# EAGLE design LED_Board (EAGLE 9.1.2)
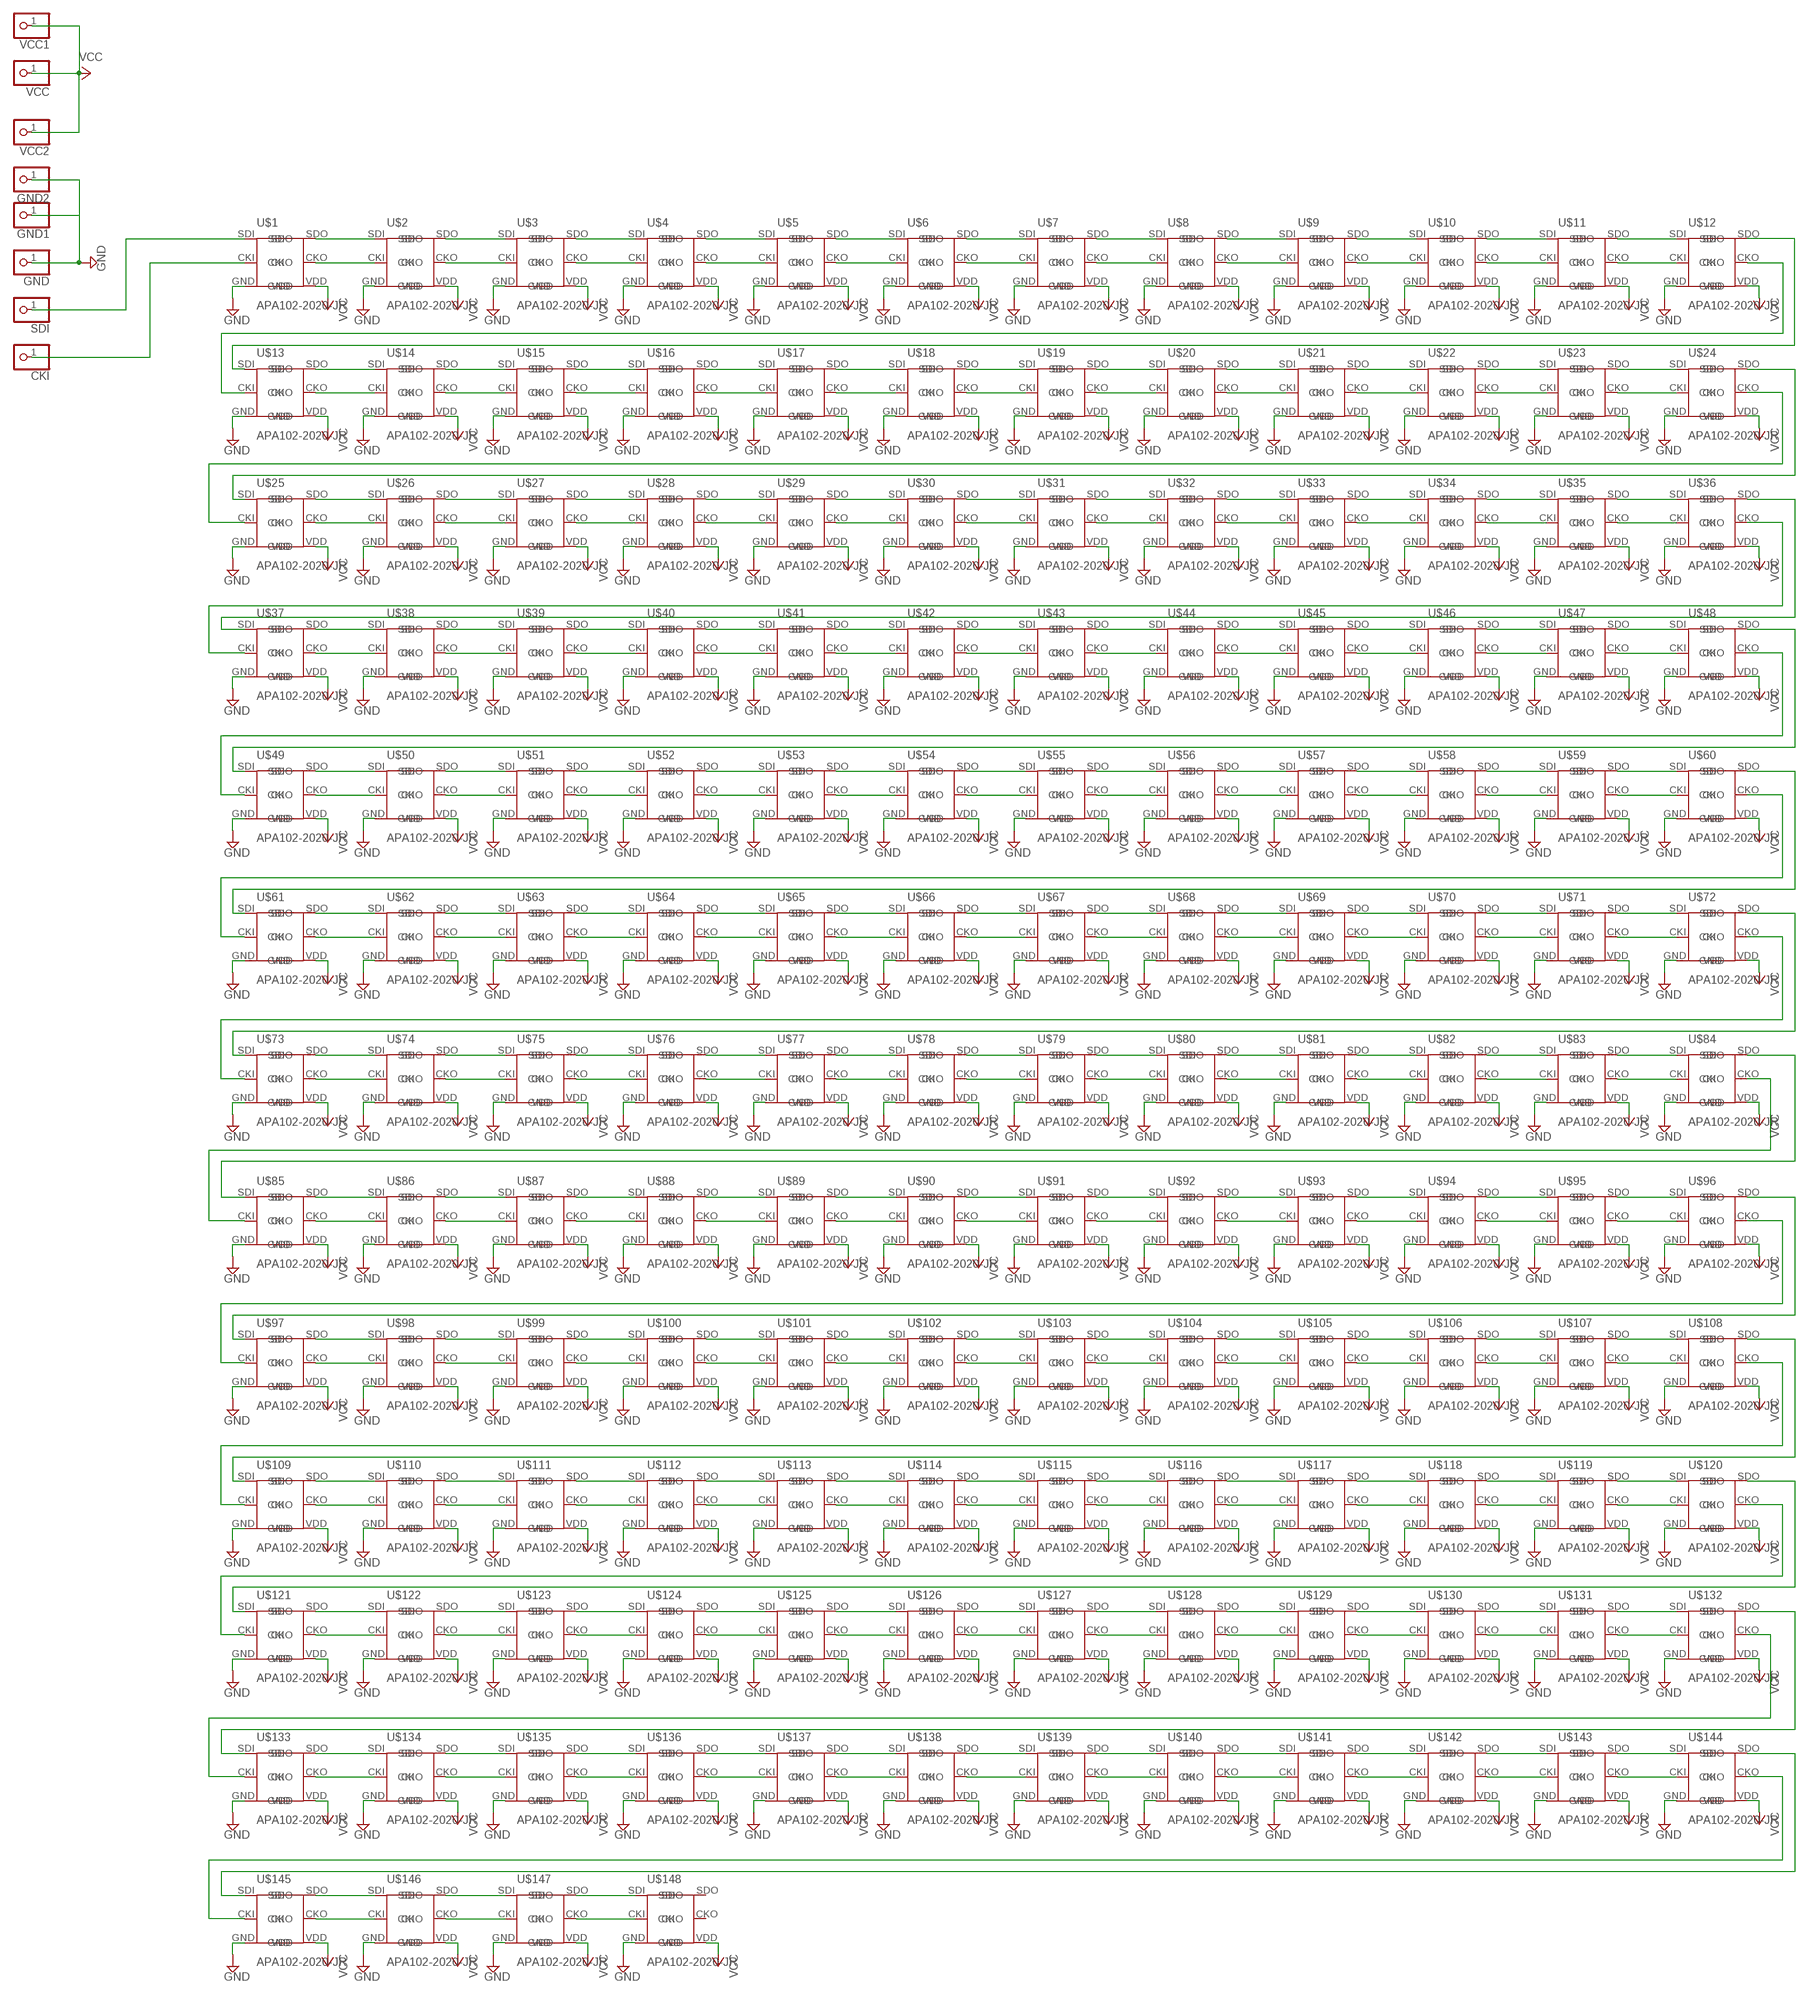
[diagram p0: schematic, sheet 1]

## Parts
CKI  PINHD-1X1  [1X01]
GND  PINHD-1X1  [1X01]
GND1  PINHD-1X1  [1X01]
GND2  PINHD-1X1  [1X01]
SDI  PINHD-1X1  [1X01]
U$1  APA102-2020-JR  [APA102-2020-JR]
U$2  APA102-2020-JR  [APA102-2020-JR]
U$3  APA102-2020-JR  [APA102-2020-JR]
U$4  APA102-2020-JR  [APA102-2020-JR]
U$5  APA102-2020-JR  [APA102-2020-JR]
U$6  APA102-2020-JR  [APA102-2020-JR]
U$7  APA102-2020-JR  [APA102-2020-JR]
U$8  APA102-2020-JR  [APA102-2020-JR]
U$9  APA102-2020-JR  [APA102-2020-JR]
U$10  APA102-2020-JR  [APA102-2020-JR]
U$11  APA102-2020-JR  [APA102-2020-JR]
U$12  APA102-2020-JR  [APA102-2020-JR]
U$13  APA102-2020-JR  [APA102-2020-JR]
U$14  APA102-2020-JR  [APA102-2020-JR]
U$15  APA102-2020-JR  [APA102-2020-JR]
U$16  APA102-2020-JR  [APA102-2020-JR]
U$17  APA102-2020-JR  [APA102-2020-JR]
U$18  APA102-2020-JR  [APA102-2020-JR]
U$19  APA102-2020-JR  [APA102-2020-JR]
U$20  APA102-2020-JR  [APA102-2020-JR]
U$21  APA102-2020-JR  [APA102-2020-JR]
U$22  APA102-2020-JR  [APA102-2020-JR]
U$23  APA102-2020-JR  [APA102-2020-JR]
U$24  APA102-2020-JR  [APA102-2020-JR]
U$25  APA102-2020-JR  [APA102-2020-JR]
U$26  APA102-2020-JR  [APA102-2020-JR]
U$27  APA102-2020-JR  [APA102-2020-JR]
U$28  APA102-2020-JR  [APA102-2020-JR]
U$29  APA102-2020-JR  [APA102-2020-JR]
U$30  APA102-2020-JR  [APA102-2020-JR]
U$31  APA102-2020-JR  [APA102-2020-JR]
U$32  APA102-2020-JR  [APA102-2020-JR]
U$33  APA102-2020-JR  [APA102-2020-JR]
U$34  APA102-2020-JR  [APA102-2020-JR]
U$35  APA102-2020-JR  [APA102-2020-JR]
U$36  APA102-2020-JR  [APA102-2020-JR]
U$37  APA102-2020-JR  [APA102-2020-JR]
U$38  APA102-2020-JR  [APA102-2020-JR]
U$39  APA102-2020-JR  [APA102-2020-JR]
U$40  APA102-2020-JR  [APA102-2020-JR]
U$41  APA102-2020-JR  [APA102-2020-JR]
U$42  APA102-2020-JR  [APA102-2020-JR]
U$43  APA102-2020-JR  [APA102-2020-JR]
U$44  APA102-2020-JR  [APA102-2020-JR]
U$45  APA102-2020-JR  [APA102-2020-JR]
U$46  APA102-2020-JR  [APA102-2020-JR]
U$47  APA102-2020-JR  [APA102-2020-JR]
U$48  APA102-2020-JR  [APA102-2020-JR]
U$49  APA102-2020-JR  [APA102-2020-JR]
U$50  APA102-2020-JR  [APA102-2020-JR]
U$51  APA102-2020-JR  [APA102-2020-JR]
U$52  APA102-2020-JR  [APA102-2020-JR]
U$53  APA102-2020-JR  [APA102-2020-JR]
U$54  APA102-2020-JR  [APA102-2020-JR]
U$55  APA102-2020-JR  [APA102-2020-JR]
U$56  APA102-2020-JR  [APA102-2020-JR]
U$57  APA102-2020-JR  [APA102-2020-JR]
U$58  APA102-2020-JR  [APA102-2020-JR]
U$59  APA102-2020-JR  [APA102-2020-JR]
U$60  APA102-2020-JR  [APA102-2020-JR]
U$61  APA102-2020-JR  [APA102-2020-JR]
U$62  APA102-2020-JR  [APA102-2020-JR]
U$63  APA102-2020-JR  [APA102-2020-JR]
U$64  APA102-2020-JR  [APA102-2020-JR]
U$65  APA102-2020-JR  [APA102-2020-JR]
U$66  APA102-2020-JR  [APA102-2020-JR]
U$67  APA102-2020-JR  [APA102-2020-JR]
U$68  APA102-2020-JR  [APA102-2020-JR]
U$69  APA102-2020-JR  [APA102-2020-JR]
U$70  APA102-2020-JR  [APA102-2020-JR]
U$71  APA102-2020-JR  [APA102-2020-JR]
U$72  APA102-2020-JR  [APA102-2020-JR]
U$73  APA102-2020-JR  [APA102-2020-JR]
U$74  APA102-2020-JR  [APA102-2020-JR]
U$75  APA102-2020-JR  [APA102-2020-JR]
U$76  APA102-2020-JR  [APA102-2020-JR]
U$77  APA102-2020-JR  [APA102-2020-JR]
U$78  APA102-2020-JR  [APA102-2020-JR]
U$79  APA102-2020-JR  [APA102-2020-JR]
U$80  APA102-2020-JR  [APA102-2020-JR]
U$81  APA102-2020-JR  [APA102-2020-JR]
U$82  APA102-2020-JR  [APA102-2020-JR]
U$83  APA102-2020-JR  [APA102-2020-JR]
U$84  APA102-2020-JR  [APA102-2020-JR]
U$85  APA102-2020-JR  [APA102-2020-JR]
U$86  APA102-2020-JR  [APA102-2020-JR]
U$87  APA102-2020-JR  [APA102-2020-JR]
U$88  APA102-2020-JR  [APA102-2020-JR]
U$89  APA102-2020-JR  [APA102-2020-JR]
U$90  APA102-2020-JR  [APA102-2020-JR]
U$91  APA102-2020-JR  [APA102-2020-JR]
U$92  APA102-2020-JR  [APA102-2020-JR]
U$93  APA102-2020-JR  [APA102-2020-JR]
U$94  APA102-2020-JR  [APA102-2020-JR]
U$95  APA102-2020-JR  [APA102-2020-JR]
U$96  APA102-2020-JR  [APA102-2020-JR]
U$97  APA102-2020-JR  [APA102-2020-JR]
U$98  APA102-2020-JR  [APA102-2020-JR]
U$99  APA102-2020-JR  [APA102-2020-JR]
U$100  APA102-2020-JR  [APA102-2020-JR]
U$101  APA102-2020-JR  [APA102-2020-JR]
U$102  APA102-2020-JR  [APA102-2020-JR]
U$103  APA102-2020-JR  [APA102-2020-JR]
U$104  APA102-2020-JR  [APA102-2020-JR]
U$105  APA102-2020-JR  [APA102-2020-JR]
U$106  APA102-2020-JR  [APA102-2020-JR]
U$107  APA102-2020-JR  [APA102-2020-JR]
U$108  APA102-2020-JR  [APA102-2020-JR]
U$109  APA102-2020-JR  [APA102-2020-JR]
U$110  APA102-2020-JR  [APA102-2020-JR]
U$111  APA102-2020-JR  [APA102-2020-JR]
U$112  APA102-2020-JR  [APA102-2020-JR]
U$113  APA102-2020-JR  [APA102-2020-JR]
U$114  APA102-2020-JR  [APA102-2020-JR]
U$115  APA102-2020-JR  [APA102-2020-JR]
U$116  APA102-2020-JR  [APA102-2020-JR]
U$117  APA102-2020-JR  [APA102-2020-JR]
U$118  APA102-2020-JR  [APA102-2020-JR]
U$119  APA102-2020-JR  [APA102-2020-JR]
U$120  APA102-2020-JR  [APA102-2020-JR]
U$121  APA102-2020-JR  [APA102-2020-JR]
U$122  APA102-2020-JR  [APA102-2020-JR]
U$123  APA102-2020-JR  [APA102-2020-JR]
U$124  APA102-2020-JR  [APA102-2020-JR]
U$125  APA102-2020-JR  [APA102-2020-JR]
U$126  APA102-2020-JR  [APA102-2020-JR]
U$127  APA102-2020-JR  [APA102-2020-JR]
U$128  APA102-2020-JR  [APA102-2020-JR]
U$129  APA102-2020-JR  [APA102-2020-JR]
U$130  APA102-2020-JR  [APA102-2020-JR]
U$131  APA102-2020-JR  [APA102-2020-JR]
U$132  APA102-2020-JR  [APA102-2020-JR]
U$133  APA102-2020-JR  [APA102-2020-JR]
U$134  APA102-2020-JR  [APA102-2020-JR]
U$135  APA102-2020-JR  [APA102-2020-JR]
U$136  APA102-2020-JR  [APA102-2020-JR]
U$137  APA102-2020-JR  [APA102-2020-JR]
U$138  APA102-2020-JR  [APA102-2020-JR]
U$139  APA102-2020-JR  [APA102-2020-JR]
U$140  APA102-2020-JR  [APA102-2020-JR]
U$141  APA102-2020-JR  [APA102-2020-JR]
U$142  APA102-2020-JR  [APA102-2020-JR]
U$143  APA102-2020-JR  [APA102-2020-JR]
U$144  APA102-2020-JR  [APA102-2020-JR]
U$145  APA102-2020-JR  [APA102-2020-JR]
U$146  APA102-2020-JR  [APA102-2020-JR]
U$147  APA102-2020-JR  [APA102-2020-JR]
U$148  APA102-2020-JR  [APA102-2020-JR]
VCC  PINHD-1X1  [1X01]
VCC1  PINHD-1X1  [1X01]
VCC2  PINHD-1X1  [1X01]

## Nets
CK-01: U$4.CKO U$5.CKI
CK-02: U$12.CKO U$13.CKI
CK-03: U$22.CKO U$23.CKI
CK-04: U$34.CKO U$35.CKI
CK-05: U$46.CKO U$47.CKI
CK-06: U$60.CKO U$61.CKI
CK-07: U$74.CKO U$75.CKI
CK-08: U$88.CKO U$89.CKI
CK-09: U$102.CKO U$103.CKI
CK-10: U$114.CKO U$115.CKI
CK-11: U$126.CKO U$127.CKI
CK-12: U$136.CKO U$137.CKI
CK-13: U$144.CKO U$145.CKI
GND: GND1.1 GND2.1 GND.1 U$1.GND U$2.GND U$3.GND U$4.GND U$5.GND U$6.GND U$7.GND U$8.GND U$9.GND U$10.GND U$11.GND U$12.GND U$13.GND U$14.GND U$15.GND U$16.GND U$17.GND U$18.GND U$19.GND U$20.GND U$21.GND U$22.GND U$23.GND U$24.GND U$25.GND U$26.GND U$27.GND U$28.GND U$29.GND U$30.GND U$31.GND U$32.GND U$33.GND U$34.GND U$35.GND U$36.GND U$37.GND U$38.GND U$39.GND U$40.GND U$41.GND U$42.GND U$43.GND U$44.GND U$45.GND U$46.GND U$47.GND U$48.GND U$49.GND U$50.GND U$51.GND U$52.GND U$53.GND U$54.GND U$55.GND U$56.GND U$57.GND U$58.GND U$59.GND U$60.GND U$61.GND U$62.GND U$63.GND U$64.GND U$65.GND U$66.GND U$67.GND U$68.GND U$69.GND U$70.GND U$71.GND U$72.GND U$73.GND U$74.GND U$75.GND U$76.GND U$77.GND U$78.GND U$79.GND U$80.GND U$81.GND U$82.GND U$83.GND U$84.GND U$85.GND U$86.GND U$87.GND U$88.GND U$89.GND U$90.GND U$91.GND U$92.GND U$93.GND U$94.GND U$95.GND U$96.GND U$97.GND U$98.GND U$99.GND U$100.GND U$101.GND U$102.GND U$103.GND U$104.GND U$105.GND U$106.GND U$107.GND U$108.GND U$109.GND U$110.GND U$111.GND U$112.GND U$113.GND U$114.GND U$115.GND U$116.GND U$117.GND U$118.GND U$119.GND U$120.GND U$121.GND U$122.GND U$123.GND U$124.GND U$125.GND U$126.GND U$127.GND U$128.GND U$129.GND U$130.GND U$131.GND U$132.GND U$133.GND U$134.GND U$135.GND U$136.GND U$137.GND U$138.GND U$139.GND U$140.GND U$141.GND U$142.GND U$143.GND U$144.GND U$145.GND U$146.GND U$147.GND U$148.GND
N$1: SDI.1 U$1.SDI
N$2: CKI.1 U$1.CKI
N$3: U$11.CKO U$12.CKI
N$4: U$11.SDO U$12.SDI
N$5: U$10.CKO U$11.CKI
N$6: U$10.SDO U$11.SDI
N$7: U$9.SDO U$10.SDI
N$8: U$9.CKO U$10.CKI
N$9: U$8.SDO U$9.SDI
N$10: U$8.CKO U$9.CKI
N$11: U$7.SDO U$8.SDI
N$12: U$7.CKO U$8.CKI
N$13: U$6.SDO U$7.SDI
N$14: U$6.CKO U$7.CKI
N$15: U$5.SDO U$6.SDI
N$16: U$5.CKO U$6.CKI
N$19: U$3.SDO U$4.SDI
N$20: U$3.CKO U$4.CKI
N$21: U$2.SDO U$3.SDI
N$22: U$2.CKO U$3.CKI
N$23: U$1.SDO U$2.SDI
N$24: U$1.CKO U$2.CKI
N$25: U$23.CKO U$24.CKI
N$26: U$23.SDO U$24.SDI
N$29: U$21.SDO U$22.SDI
N$30: U$21.CKO U$22.CKI
N$31: U$20.SDO U$21.SDI
N$32: U$20.CKO U$21.CKI
N$33: U$19.SDO U$20.SDI
N$34: U$19.CKO U$20.CKI
N$35: U$18.SDO U$19.SDI
N$36: U$18.CKO U$19.CKI
N$37: U$17.SDO U$18.SDI
N$38: U$17.CKO U$18.CKI
N$39: U$16.SDO U$17.SDI
N$40: U$16.CKO U$17.CKI
N$41: U$15.SDO U$16.SDI
N$42: U$15.CKO U$16.CKI
N$43: U$14.SDO U$15.SDI
N$44: U$14.CKO U$15.CKI
N$45: U$13.SDO U$14.SDI
N$46: U$13.CKO U$14.CKI
N$47: U$35.CKO U$36.CKI
N$48: U$35.SDO U$36.SDI
N$51: U$33.SDO U$34.SDI
N$52: U$33.CKO U$34.CKI
N$53: U$32.SDO U$33.SDI
N$54: U$32.CKO U$33.CKI
N$55: U$31.SDO U$32.SDI
N$56: U$31.CKO U$32.CKI
N$57: U$30.SDO U$31.SDI
N$58: U$30.CKO U$31.CKI
N$59: U$29.SDO U$30.SDI
N$60: U$29.CKO U$30.CKI
N$61: U$28.SDO U$29.SDI
N$62: U$28.CKO U$29.CKI
N$63: U$27.SDO U$28.SDI
N$64: U$27.CKO U$28.CKI
N$65: U$26.SDO U$27.SDI
N$66: U$26.CKO U$27.CKI
N$67: U$25.SDO U$26.SDI
N$68: U$25.CKO U$26.CKI
N$69: U$47.CKO U$48.CKI
N$70: U$47.SDO U$48.SDI
N$73: U$45.SDO U$46.SDI
N$74: U$45.CKO U$46.CKI
N$75: U$44.SDO U$45.SDI
N$76: U$44.CKO U$45.CKI
N$77: U$43.SDO U$44.SDI
N$78: U$43.CKO U$44.CKI
N$79: U$42.SDO U$43.SDI
N$80: U$42.CKO U$43.CKI
N$81: U$41.SDO U$42.SDI
N$82: U$41.CKO U$42.CKI
N$83: U$40.SDO U$41.SDI
N$84: U$40.CKO U$41.CKI
N$85: U$39.SDO U$40.SDI
N$86: U$39.CKO U$40.CKI
N$87: U$38.SDO U$39.SDI
N$88: U$38.CKO U$39.CKI
N$89: U$37.SDO U$38.SDI
N$90: U$37.CKO U$38.CKI
N$91: U$59.CKO U$60.CKI
N$92: U$59.SDO U$60.SDI
N$93: U$58.CKO U$59.CKI
N$94: U$58.SDO U$59.SDI
N$95: U$57.SDO U$58.SDI
N$96: U$57.CKO U$58.CKI
N$97: U$56.SDO U$57.SDI
N$98: U$56.CKO U$57.CKI
N$99: U$55.SDO U$56.SDI
N$100: U$55.CKO U$56.CKI
N$101: U$54.SDO U$55.SDI
N$102: U$54.CKO U$55.CKI
N$103: U$53.SDO U$54.SDI
N$104: U$53.CKO U$54.CKI
N$105: U$52.SDO U$53.SDI
N$106: U$52.CKO U$53.CKI
N$107: U$51.SDO U$52.SDI
N$108: U$51.CKO U$52.CKI
N$109: U$50.SDO U$51.SDI
N$110: U$50.CKO U$51.CKI
N$111: U$49.SDO U$50.SDI
N$112: U$49.CKO U$50.CKI
N$113: U$71.CKO U$72.CKI
N$114: U$71.SDO U$72.SDI
N$115: U$70.CKO U$71.CKI
N$116: U$70.SDO U$71.SDI
N$117: U$69.SDO U$70.SDI
N$118: U$69.CKO U$70.CKI
N$119: U$68.SDO U$69.SDI
N$120: U$68.CKO U$69.CKI
N$121: U$67.SDO U$68.SDI
N$122: U$67.CKO U$68.CKI
N$123: U$66.SDO U$67.SDI
N$124: U$66.CKO U$67.CKI
N$125: U$65.SDO U$66.SDI
N$126: U$65.CKO U$66.CKI
N$127: U$64.SDO U$65.SDI
N$128: U$64.CKO U$65.CKI
N$129: U$63.SDO U$64.SDI
N$130: U$63.CKO U$64.CKI
N$131: U$62.SDO U$63.SDI
N$132: U$62.CKO U$63.CKI
N$133: U$61.SDO U$62.SDI
N$134: U$61.CKO U$62.CKI
N$135: U$83.CKO U$84.CKI
N$136: U$83.SDO U$84.SDI
N$137: U$82.CKO U$83.CKI
N$138: U$82.SDO U$83.SDI
N$139: U$81.SDO U$82.SDI
N$140: U$81.CKO U$82.CKI
N$141: U$80.SDO U$81.SDI
N$142: U$80.CKO U$81.CKI
N$143: U$79.SDO U$80.SDI
N$144: U$79.CKO U$80.CKI
N$145: U$78.SDO U$79.SDI
N$146: U$78.CKO U$79.CKI
N$147: U$77.SDO U$78.SDI
N$148: U$77.CKO U$78.CKI
N$149: U$76.SDO U$77.SDI
N$150: U$76.CKO U$77.CKI
N$151: U$75.SDO U$76.SDI
N$152: U$75.CKO U$76.CKI
N$155: U$73.SDO U$74.SDI
N$156: U$73.CKO U$74.CKI
N$157: U$95.CKO U$96.CKI
N$158: U$95.SDO U$96.SDI
N$159: U$94.CKO U$95.CKI
N$160: U$94.SDO U$95.SDI
N$161: U$93.SDO U$94.SDI
N$162: U$93.CKO U$94.CKI
N$163: U$92.SDO U$93.SDI
N$164: U$92.CKO U$93.CKI
N$165: U$91.SDO U$92.SDI
N$166: U$91.CKO U$92.CKI
N$167: U$90.SDO U$91.SDI
N$168: U$90.CKO U$91.CKI
N$169: U$89.SDO U$90.SDI
N$170: U$89.CKO U$90.CKI
N$173: U$87.SDO U$88.SDI
N$174: U$87.CKO U$88.CKI
N$175: U$86.SDO U$87.SDI
N$176: U$86.CKO U$87.CKI
N$177: U$85.SDO U$86.SDI
N$178: U$85.CKO U$86.CKI
N$179: U$107.CKO U$108.CKI
N$180: U$107.SDO U$108.SDI
N$181: U$106.CKO U$107.CKI
N$182: U$106.SDO U$107.SDI
N$183: U$105.SDO U$106.SDI
N$184: U$105.CKO U$106.CKI
N$185: U$104.SDO U$105.SDI
N$186: U$104.CKO U$105.CKI
N$187: U$103.SDO U$104.SDI
N$188: U$103.CKO U$104.CKI
N$191: U$101.SDO U$102.SDI
N$192: U$101.CKO U$102.CKI
N$193: U$100.SDO U$101.SDI
N$194: U$100.CKO U$101.CKI
N$195: U$99.SDO U$100.SDI
N$196: U$99.CKO U$100.CKI
N$197: U$98.SDO U$99.SDI
N$198: U$98.CKO U$99.CKI
N$199: U$97.SDO U$98.SDI
N$200: U$97.CKO U$98.CKI
N$201: U$119.CKO U$120.CKI
N$202: U$119.SDO U$120.SDI
N$203: U$118.CKO U$119.CKI
N$204: U$118.SDO U$119.SDI
N$205: U$117.SDO U$118.SDI
N$206: U$117.CKO U$118.CKI
N$207: U$116.SDO U$117.SDI
N$208: U$116.CKO U$117.CKI
N$209: U$115.SDO U$116.SDI
N$210: U$115.CKO U$116.CKI
N$213: U$113.SDO U$114.SDI
N$214: U$113.CKO U$114.CKI
N$215: U$112.SDO U$113.SDI
N$216: U$112.CKO U$113.CKI
N$217: U$111.SDO U$112.SDI
N$218: U$111.CKO U$112.CKI
N$219: U$110.SDO U$111.SDI
N$220: U$110.CKO U$111.CKI
N$221: U$109.SDO U$110.SDI
N$222: U$109.CKO U$110.CKI
N$223: U$131.CKO U$132.CKI
N$224: U$131.SDO U$132.SDI
N$225: U$130.CKO U$131.CKI
N$226: U$130.SDO U$131.SDI
N$227: U$129.SDO U$130.SDI
N$228: U$129.CKO U$130.CKI
N$229: U$128.SDO U$129.SDI
N$230: U$128.CKO U$129.CKI
N$231: U$127.SDO U$128.SDI
N$232: U$127.CKO U$128.CKI
N$235: U$125.SDO U$126.SDI
N$236: U$125.CKO U$126.CKI
N$237: U$124.SDO U$125.SDI
N$238: U$124.CKO U$125.CKI
N$239: U$123.SDO U$124.SDI
N$240: U$123.CKO U$124.CKI
N$241: U$122.SDO U$123.SDI
N$242: U$122.CKO U$123.CKI
N$243: U$121.SDO U$122.SDI
N$244: U$121.CKO U$122.CKI
N$245: U$143.CKO U$144.CKI
N$246: U$143.SDO U$144.SDI
N$247: U$142.CKO U$143.CKI
N$248: U$142.SDO U$143.SDI
N$249: U$141.SDO U$142.SDI
N$250: U$141.CKO U$142.CKI
N$251: U$140.SDO U$141.SDI
N$252: U$140.CKO U$141.CKI
N$253: U$139.SDO U$140.SDI
N$254: U$139.CKO U$140.CKI
N$255: U$138.SDO U$139.SDI
N$256: U$138.CKO U$139.CKI
N$257: U$137.SDO U$138.SDI
N$258: U$137.CKO U$138.CKI
N$261: U$135.SDO U$136.SDI
N$262: U$135.CKO U$136.CKI
N$263: U$134.SDO U$135.SDI
N$264: U$134.CKO U$135.CKI
N$265: U$133.SDO U$134.SDI
N$266: U$133.CKO U$134.CKI
N$269: U$24.SDO U$25.SDI
N$270: U$24.CKO U$25.CKI
N$271: U$36.SDO U$37.SDI
N$272: U$36.CKO U$37.CKI
N$273: U$48.SDO U$49.SDI
N$274: U$48.CKO U$49.CKI
N$277: U$72.SDO U$73.SDI
N$278: U$72.CKO U$73.CKI
N$279: U$84.SDO U$85.SDI
N$280: U$84.CKO U$85.CKI
N$281: U$96.SDO U$97.SDI
N$282: U$96.CKO U$97.CKI
N$283: U$147.SDO U$148.SDI
N$284: U$147.CKO U$148.CKI
N$285: U$146.SDO U$147.SDI
N$286: U$146.CKO U$147.CKI
N$287: U$145.SDO U$146.SDI
N$288: U$145.CKO U$146.CKI
N$289: U$108.SDO U$109.SDI
N$290: U$108.CKO U$109.CKI
N$291: U$120.SDO U$121.SDI
N$292: U$120.CKO U$121.CKI
N$293: U$132.SDO U$133.SDI
N$294: U$132.CKO U$133.CKI
SD-01: U$4.SDO U$5.SDI
SD-02: U$12.SDO U$13.SDI
SD-03: U$22.SDO U$23.SDI
SD-04: U$34.SDO U$35.SDI
SD-05: U$46.SDO U$47.SDI
SD-06: U$60.SDO U$61.SDI
SD-07: U$74.SDO U$75.SDI
SD-08: U$88.SDO U$89.SDI
SD-09: U$102.SDO U$103.SDI
SD-10: U$114.SDO U$115.SDI
SD-11: U$126.SDO U$127.SDI
SD-12: U$136.SDO U$137.SDI
SD-13: U$144.SDO U$145.SDI
VCC: U$1.VDD U$2.VDD U$3.VDD U$4.VDD U$5.VDD U$6.VDD U$7.VDD U$8.VDD U$9.VDD U$10.VDD U$11.VDD U$12.VDD U$13.VDD U$14.VDD U$15.VDD U$16.VDD U$17.VDD U$18.VDD U$19.VDD U$20.VDD U$21.VDD U$22.VDD U$23.VDD U$24.VDD U$25.VDD U$26.VDD U$27.VDD U$28.VDD U$29.VDD U$30.VDD U$31.VDD U$32.VDD U$33.VDD U$34.VDD U$35.VDD U$36.VDD U$37.VDD U$38.VDD U$39.VDD U$40.VDD U$41.VDD U$42.VDD U$43.VDD U$44.VDD U$45.VDD U$46.VDD U$47.VDD U$48.VDD U$49.VDD U$50.VDD U$51.VDD U$52.VDD U$53.VDD U$54.VDD U$55.VDD U$56.VDD U$57.VDD U$58.VDD U$59.VDD U$60.VDD U$61.VDD U$62.VDD U$63.VDD U$64.VDD U$65.VDD U$66.VDD U$67.VDD U$68.VDD U$69.VDD U$70.VDD U$71.VDD U$72.VDD U$73.VDD U$74.VDD U$75.VDD U$76.VDD U$77.VDD U$78.VDD U$79.VDD U$80.VDD U$81.VDD U$82.VDD U$83.VDD U$84.VDD U$85.VDD U$86.VDD U$87.VDD U$88.VDD U$89.VDD U$90.VDD U$91.VDD U$92.VDD U$93.VDD U$94.VDD U$95.VDD U$96.VDD U$97.VDD U$98.VDD U$99.VDD U$100.VDD U$101.VDD U$102.VDD U$103.VDD U$104.VDD U$105.VDD U$106.VDD U$107.VDD U$108.VDD U$109.VDD U$110.VDD U$111.VDD U$112.VDD U$113.VDD U$114.VDD U$115.VDD U$116.VDD U$117.VDD U$118.VDD U$119.VDD U$120.VDD U$121.VDD U$122.VDD U$123.VDD U$124.VDD U$125.VDD U$126.VDD U$127.VDD U$128.VDD U$129.VDD U$130.VDD U$131.VDD U$132.VDD U$133.VDD U$134.VDD U$135.VDD U$136.VDD U$137.VDD U$138.VDD U$139.VDD U$140.VDD U$141.VDD U$142.VDD U$143.VDD U$144.VDD U$145.VDD U$146.VDD U$147.VDD U$148.VDD VCC1.1 VCC2.1 VCC.1
Unconnected: U$148.CKO U$148.SDO

## Library data of the parts
CKI GND GND1 GND2 SDI VCC VCC1 VCC2 = adafruit:PINHD-1X1: Pin header 1x1 for 0.1" spacing With round pins
U$1-U$148 = R2-PSI:APA102-2020-JR

## Board
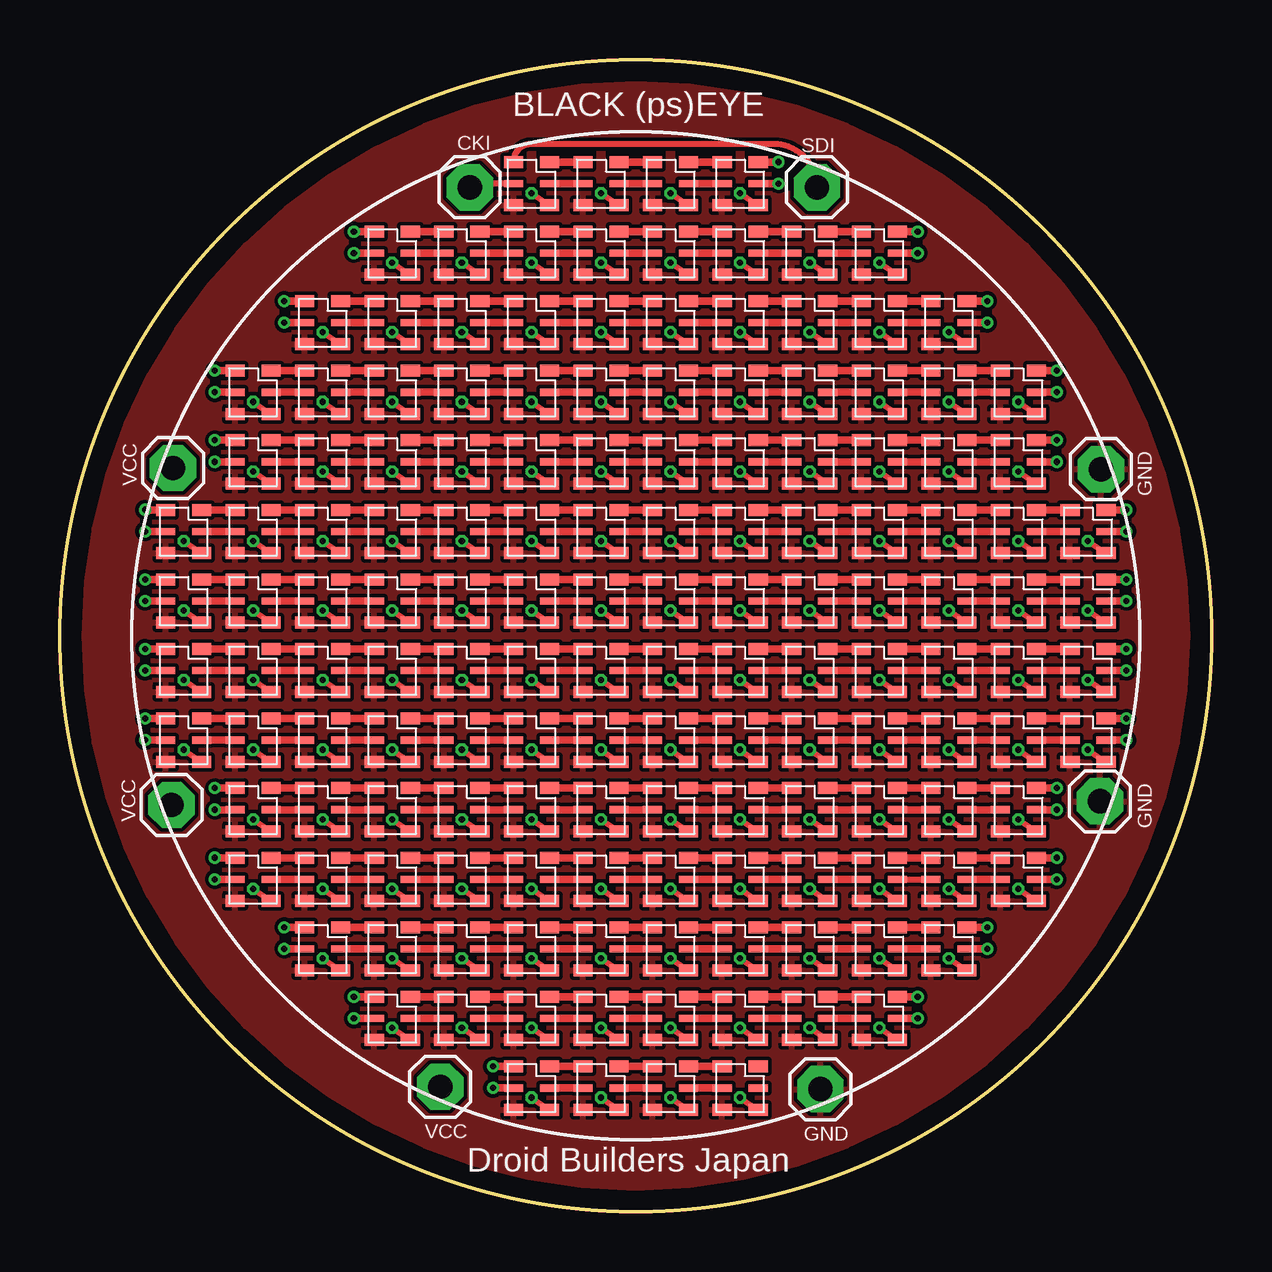
[diagram p1: board, top side]
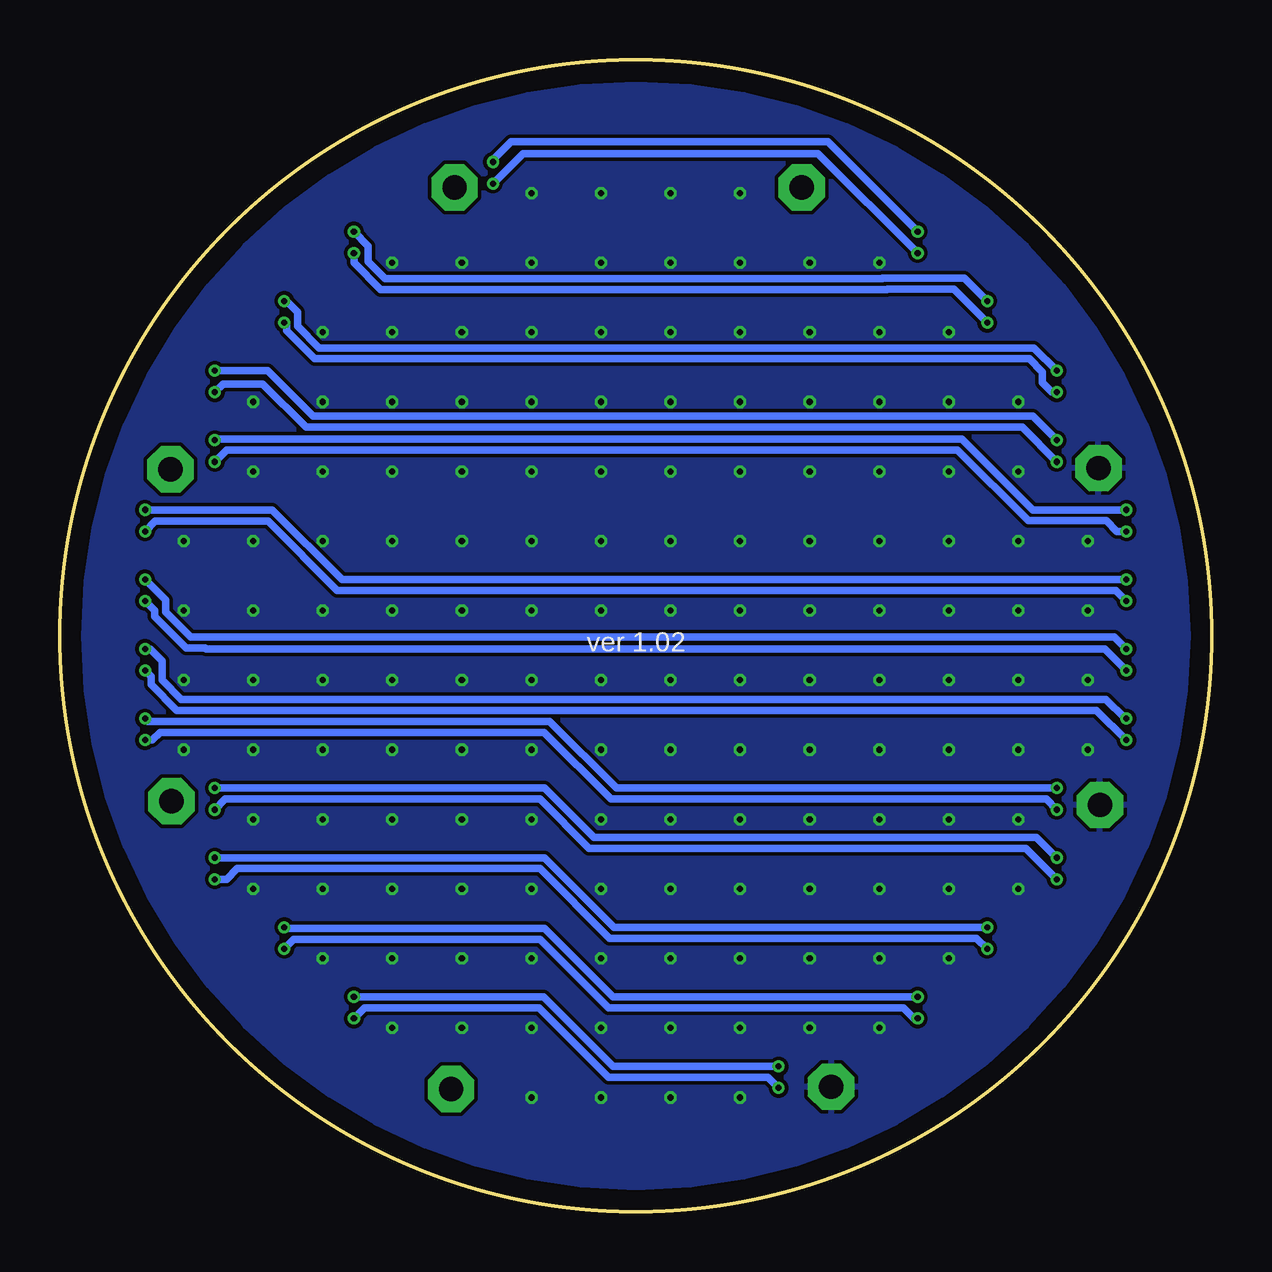
[diagram p2: board, bottom side, seen from below]

Size 48 x 48 mm. Coordinates in mm from the lower left corner, seen from the top.
Outline: circle at 24,24 radius 24
Copper layers (1*16): Top 0.035559375mm / dielectric 1.6mm / Bottom 0.035559375mm
Design rules "oshpark-2layer *": minimum track width 6mil, minimum drill 10mil, track to track 6mil, track to pad 6mil, pad to pad 6mil, via to via 6mil, smd to smd 6mil, copper to edge 15mil, drill to drill 6mil, minimum pad ring 5mil, minimum via ring 5mil, stop-mask expansion 2.5mil, vias tented up to drill 11mil, thermal gap 6mil

### Footprints (pad centres in the part's own frame; a part is rotated, then mirrored left to right if it is on the bottom)
1X01 = drill 1.016 pad 1.93 octagon: 1 0,0
APA102-2020-JR = smd 0.8 x 0.3: CKI -0.75,0; CKO 0.75,0 | smd 0.8 x 0.5: GND -0.75,-0.9; SDI -0.75,0.9; SDO 0.75,0.9; VDD 0.75,-0.9

### Placement (x,y rotation side)
CKI  17.08,42.69 0 top
GND  43.39,30.94 0 top
GND1  43.35,17.1 0 top
GND2  31.7,5.1 0 top
SDI  31.55,42.69 0 top
U$1  19.65,42.85 0 top
U$2  22.55,42.85 0 top
U$3  25.45,42.85 0 top
U$4  28.35,42.85 0 top
U$5  13.85,39.95 0 top
U$6  16.75,39.95 0 top
U$7  19.65,39.95 0 top
U$8  22.55,39.95 0 top
U$9  25.45,39.95 0 top
U$10  28.35,39.95 0 top
U$11  31.25,39.95 0 top
U$12  34.15,39.95 0 top
U$13  10.95,37.05 0 top
U$14  13.85,37.05 0 top
U$15  16.75,37.05 0 top
U$16  19.65,37.05 0 top
U$17  22.55,37.05 0 top
U$18  25.45,37.05 0 top
U$19  28.35,37.05 0 top
U$20  31.25,37.05 0 top
U$21  34.15,37.05 0 top
U$22  37.05,37.05 0 top
U$23  8.05,34.15 0 top
U$24  10.95,34.15 0 top
U$25  13.85,34.15 0 top
U$26  16.75,34.15 0 top
U$27  19.65,34.15 0 top
U$28  22.55,34.15 0 top
U$29  25.45,34.15 0 top
U$30  28.35,34.15 0 top
U$31  31.25,34.15 0 top
U$32  34.15,34.15 0 top
U$33  37.05,34.15 0 top
U$34  39.95,34.15 0 top
U$35  8.05,31.25 0 top
U$36  10.95,31.25 0 top
U$37  13.85,31.25 0 top
U$38  16.75,31.25 0 top
U$39  19.65,31.25 0 top
U$40  22.55,31.25 0 top
U$41  25.45,31.25 0 top
U$42  28.35,31.25 0 top
U$43  31.25,31.25 0 top
U$44  34.15,31.25 0 top
U$45  37.05,31.25 0 top
U$46  39.95,31.25 0 top
U$47  5.15,28.35 0 top
U$48  8.05,28.35 0 top
U$49  10.95,28.35 0 top
U$50  13.85,28.35 0 top
U$51  16.75,28.35 0 top
U$52  19.65,28.35 0 top
U$53  22.55,28.35 0 top
U$54  25.45,28.35 0 top
U$55  28.35,28.35 0 top
U$56  31.25,28.35 0 top
U$57  34.15,28.35 0 top
U$58  37.05,28.35 0 top
U$59  39.95,28.35 0 top
U$60  42.85,28.35 0 top
U$61  5.15,25.45 0 top
U$62  8.05,25.45 0 top
U$63  10.95,25.45 0 top
U$64  13.85,25.45 0 top
U$65  16.75,25.45 0 top
U$66  19.65,25.45 0 top
U$67  22.55,25.45 0 top
U$68  25.45,25.45 0 top
U$69  28.35,25.45 0 top
U$70  31.25,25.45 0 top
U$71  34.15,25.45 0 top
U$72  37.05,25.45 0 top
U$73  39.95,25.45 0 top
U$74  42.85,25.45 0 top
U$75  5.15,22.55 0 top
U$76  8.05,22.55 0 top
U$77  10.95,22.55 0 top
U$78  13.85,22.55 0 top
U$79  16.75,22.55 0 top
U$80  19.65,22.55 0 top
U$81  22.55,22.55 0 top
U$82  25.45,22.55 0 top
U$83  28.35,22.55 0 top
U$84  31.25,22.55 0 top
U$85  34.15,22.55 0 top
U$86  37.05,22.55 0 top
U$87  39.95,22.55 0 top
U$88  42.85,22.55 0 top
U$89  5.15,19.65 0 top
U$90  8.05,19.65 0 top
U$91  10.95,19.65 0 top
U$92  13.85,19.65 0 top
U$93  16.75,19.65 0 top
U$94  19.65,19.65 0 top
U$95  22.55,19.65 0 top
U$96  25.45,19.65 0 top
U$97  28.35,19.65 0 top
U$98  31.25,19.65 0 top
U$99  34.15,19.65 0 top
U$100  37.05,19.65 0 top
U$101  39.95,19.65 0 top
U$102  42.85,19.65 0 top
U$103  8.05,16.75 0 top
U$104  10.95,16.75 0 top
U$105  13.85,16.75 0 top
U$106  16.75,16.75 0 top
U$107  19.65,16.75 0 top
U$108  22.55,16.75 0 top
U$109  25.45,16.75 0 top
U$110  28.35,16.75 0 top
U$111  31.25,16.75 0 top
U$112  34.15,16.75 0 top
U$113  37.05,16.75 0 top
U$114  39.95,16.75 0 top
U$115  8.05,13.85 0 top
U$116  10.95,13.85 0 top
U$117  13.85,13.85 0 top
U$118  16.75,13.85 0 top
U$119  19.65,13.85 0 top
U$120  22.55,13.85 0 top
U$121  25.45,13.85 0 top
U$122  28.35,13.85 0 top
U$123  31.25,13.85 0 top
U$124  34.15,13.85 0 top
U$125  37.05,13.85 0 top
U$126  39.95,13.85 0 top
U$127  10.95,10.95 0 top
U$128  13.85,10.95 0 top
U$129  16.75,10.95 0 top
U$130  19.65,10.95 0 top
U$131  22.55,10.95 0 top
U$132  25.45,10.95 0 top
U$133  28.35,10.95 0 top
U$134  31.25,10.95 0 top
U$135  34.15,10.95 0 top
U$136  37.05,10.95 0 top
U$137  13.85,8.05 0 top
U$138  16.75,8.05 0 top
U$139  19.65,8.05 0 top
U$140  22.55,8.05 0 top
U$141  25.45,8.05 0 top
U$142  28.35,8.05 0 top
U$143  31.25,8.05 0 top
U$144  34.15,8.05 0 top
U$145  19.65,5.15 0 top
U$146  22.55,5.15 0 top
U$147  25.45,5.15 0 top
U$148  28.35,5.15 0 top
VCC  4.71,30.99 0 top
VCC1  4.65,16.95 0 top
VCC2  15.85,5.2 0 top

### Tracks (layer width: path | path; a pad name or v marks a point on that pad's centre or on a via)
CK-01  (via drill 0.25)
  Top 0.305: v29.95,42.85 U$4.CKO | v12.25,39.95 U$5.CKI
  Bottom 0.305: v12.25,39.95 16.4,44.1 28.7,44.1 v29.95,42.85
CK-02  (via drill 0.25)
  Top 0.305: v35.75,39.95 U$12.CKO | v9.35,37.05 U$13.CKI
  Bottom 0.305: v9.35,37.05 10.74,38.44 13.52,38.44 13.53,38.43 34.63,38.43 35.75,39.55 v35.75,39.95
CK-03  (via drill 0.25)
  Top 0.305: v38.65,37.05 U$22.CKO | v6.45,34.15 U$23.CKI
  Bottom 0.305: v38.65,37.05 38.55,36.95 38.55,36.71 37.38,35.54 7.59,35.54 7.05,35 7.05,34.55 6.65,34.15 v6.45,34.15
CK-04  (via drill 0.25)
  Top 0.305: U$34.CKO v41.55,34.15 | v6.45,31.25 U$35.CKI
  Bottom 0.305: v6.45,31.25 7.89,32.69 37.74,32.69 39.55,34.5 41.2,34.5 v41.55,34.15
CK-05  (via drill 0.25)
  Top 0.305: U$46.CKO v41.55,31.25 | v3.55,28.35 U$47.CKI
  Bottom 0.305: v3.55,28.35 3.95,28.35 4.39,28.79 7.64,28.79 10.59,31.74 41.06,31.74 v41.55,31.25
CK-06  (via drill 0.25)
  Top 0.305: U$60.CKO v44.45,28.35 | U$61.CKI v3.55,25.45
  Bottom 0.305: v3.55,25.45 3.99,25.89 36.44,25.89 39.32,28.78 44.02,28.78 v44.45,28.35
CK-07  (via drill 0.25)
  Top 0.305: U$74.CKO v44.45,25.45 | v3.55,22.55 U$75.CKI
  Bottom 0.305: v44.45,25.45 44.06,25.06 44.06,24.81 42.74,23.49 41.95,23.49 41.91,23.45 4.45,23.45 v3.55,22.55
CK-08  (via drill 0.25)
  Top 0.305: v3.55,19.65 U$89.CKI | U$88.CKO v44.45,22.55
  Bottom 0.305: v44.45,22.55 44.21,22.31 44.21,21.96 43.14,20.89 4.79,20.89 v3.55,19.65
CK-09  (via drill 0.25)
  Top 0.305: v6.45,16.75 U$103.CKI | v44.45,19.65 U$102.CKO
  Bottom 0.305: v44.45,19.65 44.15,19.65 43.82,19.98 27.82,19.98 25.04,17.19 6.89,17.19 v6.45,16.75
CK-10  (via drill 0.25)
  Top 0.305: v6.45,13.85 U$115.CKI | U$114.CKO v41.55,16.75
  Bottom 0.305: v6.45,13.85 7.74,15.14 25.94,15.14 27.99,17.19 41.11,17.19 v41.55,16.75
CK-11  (via drill 0.25)
  Top 0.305: v9.35,10.95 U$127.CKI | U$126.CKO v41.55,13.85
  Bottom 0.305: v41.55,13.85 41.05,13.85 40.61,14.29 27.99,14.29 25.09,11.39 9.79,11.39 v9.35,10.95
CK-12  (via drill 0.25)
  Top 0.305: v12.25,8.05 U$137.CKI | U$136.CKO v38.65,10.95
  Bottom 0.305: v12.25,8.05 12.4,8.05 12.84,8.49 25.14,8.49 27.99,11.34 38.26,11.34 v38.65,10.95
CK-13  (via drill 0.25)
  Top 0.305: v35.75,8.05 U$144.CKO | v18.05,5.15 U$145.CKI
  Bottom 0.305: v18.05,5.15 18.49,5.59 25.14,5.59 28.04,8.49 35.31,8.49 v35.75,8.05
GND
  pour Top: 1,24 arc180 47,24 arc180
N$1
  Top 0.254: SDI.1 arc90 29.74,44.5 19.65,44.5 arc90 U$1.SDI
N$2
  Top 0.254: U$1.CKI 17.8,42.85 arc-90 17.64,42.69 CKI.1
N$3
  Top 0.305: U$11.CKO U$12.CKI
N$4
  Top 0.305: U$11.SDO U$12.SDI
N$5
  Top 0.305: U$10.CKO U$11.CKI
N$6
  Top 0.305: U$10.SDO U$11.SDI
N$7
  Top 0.305: U$9.SDO U$10.SDI
N$8
  Top 0.305: U$9.CKO U$10.CKI
N$9
  Top 0.305: U$8.SDO U$9.SDI
N$10
  Top 0.305: U$8.CKO U$9.CKI
N$11
  Top 0.305: U$7.SDO U$8.SDI
N$12
  Top 0.305: U$7.CKO U$8.CKI
N$13
  Top 0.305: U$6.SDO U$7.SDI
N$14
  Top 0.305: U$6.CKO U$7.CKI
N$15
  Top 0.305: U$5.SDO U$6.SDI
N$16
  Top 0.305: U$5.CKO U$6.CKI
N$19
  Top 0.305: U$3.SDO U$4.SDI
N$20
  Top 0.305: U$3.CKO U$4.CKI
N$21
  Top 0.305: U$2.SDO U$3.SDI
N$22
  Top 0.305: U$2.CKO U$3.CKI
N$23
  Top 0.305: U$1.SDO U$2.SDI
N$24
  Top 0.305: U$1.CKO U$2.CKI
N$25
  Top 0.305: U$23.CKO U$24.CKI
N$26
  Top 0.305: U$23.SDO U$24.SDI
N$29
  Top 0.305: U$21.SDO U$22.SDI
N$30
  Top 0.305: U$21.CKO U$22.CKI
N$31
  Top 0.305: U$20.SDO U$21.SDI
N$32
  Top 0.305: U$20.CKO U$21.CKI
N$33
  Top 0.305: U$19.SDO U$20.SDI
N$34
  Top 0.305: U$19.CKO U$20.CKI
N$35
  Top 0.305: U$18.SDO U$19.SDI
N$36
  Top 0.305: U$18.CKO U$19.CKI
N$37
  Top 0.305: U$17.SDO U$18.SDI
N$38
  Top 0.305: U$17.CKO U$18.CKI
N$39
  Top 0.305: U$16.SDO U$17.SDI
N$40
  Top 0.305: U$16.CKO U$17.CKI
N$41
  Top 0.305: U$15.SDO U$16.SDI
N$42
  Top 0.305: U$15.CKO U$16.CKI
N$43
  Top 0.305: U$14.SDO U$15.SDI
N$44
  Top 0.305: U$14.CKO U$15.CKI
N$45
  Top 0.305: U$13.SDO U$14.SDI
N$46
  Top 0.305: U$13.CKO U$14.CKI
N$47
  Top 0.305: U$35.CKO U$36.CKI
N$48
  Top 0.305: U$35.SDO U$36.SDI
N$51
  Top 0.305: U$33.SDO U$34.SDI
N$52
  Top 0.305: U$33.CKO U$34.CKI
N$53
  Top 0.305: U$32.SDO U$33.SDI
N$54
  Top 0.305: U$32.CKO U$33.CKI
N$55
  Top 0.305: U$31.SDO U$32.SDI
N$56
  Top 0.305: U$31.CKO U$32.CKI
N$57
  Top 0.305: U$30.SDO U$31.SDI
N$58
  Top 0.305: U$30.CKO U$31.CKI
N$59
  Top 0.305: U$29.SDO U$30.SDI
N$60
  Top 0.305: U$29.CKO U$30.CKI
N$61
  Top 0.305: U$28.SDO U$29.SDI
N$62
  Top 0.305: U$28.CKO U$29.CKI
N$63
  Top 0.305: U$27.SDO U$28.SDI
N$64
  Top 0.305: U$27.CKO U$28.CKI
N$65
  Top 0.305: U$26.SDO U$27.SDI
N$66
  Top 0.305: U$26.CKO U$27.CKI
N$67
  Top 0.305: U$25.SDO U$26.SDI
N$68
  Top 0.305: U$25.CKO U$26.CKI
N$69
  Top 0.305: U$47.CKO U$48.CKI
N$70
  Top 0.305: U$47.SDO U$48.SDI
N$73
  Top 0.305: U$45.SDO U$46.SDI
N$74
  Top 0.305: U$45.CKO U$46.CKI
N$75
  Top 0.305: U$44.SDO U$45.SDI
N$76
  Top 0.305: U$44.CKO U$45.CKI
N$77
  Top 0.305: U$43.SDO U$44.SDI
N$78
  Top 0.305: U$43.CKO U$44.CKI
N$79
  Top 0.305: U$42.SDO U$43.SDI
N$80
  Top 0.305: U$42.CKO U$43.CKI
N$81
  Top 0.305: U$41.SDO U$42.SDI
N$82
  Top 0.305: U$41.CKO U$42.CKI
N$83
  Top 0.305: U$40.SDO U$41.SDI
N$84
  Top 0.305: U$40.CKO U$41.CKI
N$85
  Top 0.305: U$39.SDO U$40.SDI
N$86
  Top 0.305: U$39.CKO U$40.CKI
N$87
  Top 0.305: U$38.SDO U$39.SDI
N$88
  Top 0.305: U$38.CKO U$39.CKI
N$89
  Top 0.305: U$37.SDO U$38.SDI
N$90
  Top 0.305: U$37.CKO U$38.CKI
N$91
  Top 0.305: U$59.CKO U$60.CKI
N$92
  Top 0.305: U$59.SDO U$60.SDI
N$93
  Top 0.305: U$58.CKO U$59.CKI
N$94
  Top 0.305: U$58.SDO U$59.SDI
N$95
  Top 0.305: U$57.SDO U$58.SDI
N$96
  Top 0.305: U$57.CKO U$58.CKI
N$97
  Top 0.305: U$56.SDO U$57.SDI
N$98
  Top 0.305: U$56.CKO U$57.CKI
N$99
  Top 0.305: U$55.SDO U$56.SDI
N$100
  Top 0.305: U$55.CKO U$56.CKI
N$101
  Top 0.305: U$54.SDO U$55.SDI
N$102
  Top 0.305: U$54.CKO U$55.CKI
N$103
  Top 0.305: U$53.SDO U$54.SDI
N$104
  Top 0.305: U$53.CKO U$54.CKI
N$105
  Top 0.305: U$52.SDO U$53.SDI
N$106
  Top 0.305: U$52.CKO U$53.CKI
N$107
  Top 0.305: U$51.SDO U$52.SDI
N$108
  Top 0.305: U$51.CKO U$52.CKI
N$109
  Top 0.305: U$50.SDO U$51.SDI
N$110
  Top 0.305: U$50.CKO U$51.CKI
N$111
  Top 0.305: U$49.SDO U$50.SDI
N$112
  Top 0.305: U$49.CKO U$50.CKI
N$113
  Top 0.305: U$71.CKO U$72.CKI
N$114
  Top 0.305: U$71.SDO U$72.SDI
N$115
  Top 0.305: U$71.CKI U$70.CKO
N$116
  Top 0.305: U$70.SDO U$71.SDI
N$117
  Top 0.305: U$69.SDO U$70.SDI
N$118
  Top 0.305: U$69.CKO U$70.CKI
N$119
  Top 0.305: U$68.SDO U$69.SDI
N$120
  Top 0.305: U$68.CKO U$69.CKI
N$121
  Top 0.305: U$67.SDO U$68.SDI
N$122
  Top 0.305: U$67.CKO U$68.CKI
N$123
  Top 0.305: U$66.SDO U$67.SDI
N$124
  Top 0.305: U$66.CKO U$67.CKI
N$125
  Top 0.305: U$65.SDO U$66.SDI
N$126
  Top 0.305: U$65.CKO U$66.CKI
N$127
  Top 0.305: U$64.SDO U$65.SDI
N$128
  Top 0.305: U$64.CKO U$65.CKI
N$129
  Top 0.305: U$63.SDO U$64.SDI
N$130
  Top 0.305: U$63.CKO U$64.CKI
N$131
  Top 0.305: U$62.SDO U$63.SDI
N$132
  Top 0.305: U$62.CKO U$63.CKI
N$133
  Top 0.305: U$61.SDO U$62.SDI
N$134
  Top 0.305: U$61.CKO U$62.CKI
N$135
  Top 0.305: U$83.CKO U$84.CKI
N$136
  Top 0.305: U$83.SDO U$84.SDI
N$137
  Top 0.305: U$82.CKO U$83.CKI
N$138
  Top 0.305: U$82.SDO U$83.SDI
N$139
  Top 0.305: U$81.SDO U$82.SDI
N$140
  Top 0.305: U$81.CKO U$82.CKI
N$141
  Top 0.305: U$80.SDO U$81.SDI
N$142
  Top 0.305: U$80.CKO U$81.CKI
N$143
  Top 0.305: U$79.SDO U$80.SDI
N$144
  Top 0.305: U$79.CKO U$80.CKI
N$145
  Top 0.305: U$78.SDO U$79.SDI
N$146
  Top 0.305: U$78.CKO U$79.CKI
N$147
  Top 0.305: U$77.SDO U$78.SDI
N$148
  Top 0.305: U$77.CKO U$78.CKI
N$149
  Top 0.305: U$76.SDO U$77.SDI
N$150
  Top 0.305: U$76.CKO U$77.CKI
N$151
  Top 0.305: U$75.SDO U$76.SDI
N$152
  Top 0.305: U$75.CKO U$76.CKI
N$155
  Top 0.305: U$73.SDO U$74.SDI
N$156
  Top 0.305: U$73.CKO U$74.CKI
N$157
  Top 0.305: U$96.CKI U$95.CKO
N$158
  Top 0.305: U$95.SDO U$96.SDI
N$159
  Top 0.305: U$94.CKO U$95.CKI
N$160
  Top 0.305: U$94.SDO U$95.SDI
N$161
  Top 0.305: U$93.SDO U$94.SDI
N$162
  Top 0.305: U$93.CKO U$94.CKI
N$163
  Top 0.305: U$92.SDO U$93.SDI
N$164
  Top 0.305: U$92.CKO U$93.CKI
N$165
  Top 0.305: U$91.SDO U$92.SDI
N$166
  Top 0.305: U$91.CKO U$92.CKI
N$167
  Top 0.305: U$90.SDO U$91.SDI
N$168
  Top 0.305: U$90.CKO U$91.CKI
N$169
  Top 0.305: U$89.SDO U$90.SDI
N$170
  Top 0.305: U$89.CKO U$90.CKI
N$173
  Top 0.305: U$87.SDO U$88.SDI
N$174
  Top 0.305: U$87.CKO U$88.CKI
N$175
  Top 0.305: U$86.SDO U$87.SDI
N$176
  Top 0.305: U$86.CKO U$87.CKI
N$177
  Top 0.305: U$85.SDO U$86.SDI
N$178
  Top 0.305: U$85.CKO U$86.CKI
N$179
  Top 0.305: U$107.CKO U$108.CKI
N$180
  Top 0.305: U$107.SDO U$108.SDI
N$181
  Top 0.305: U$106.CKO U$107.CKI
N$182
  Top 0.305: U$106.SDO U$107.SDI
N$183
  Top 0.305: U$105.SDO U$106.SDI
N$184
  Top 0.305: U$105.CKO U$106.CKI
N$185
  Top 0.305: U$104.SDO U$105.SDI
N$186
  Top 0.305: U$104.CKO U$105.CKI
N$187
  Top 0.305: U$103.SDO U$104.SDI
N$188
  Top 0.305: U$103.CKO U$104.CKI
N$191
  Top 0.305: U$102.SDI U$101.SDO
N$192
  Top 0.305: U$102.CKI U$101.CKO
N$193
  Top 0.305: U$101.SDI U$100.SDO
N$194
  Top 0.305: U$100.CKO U$101.CKI
N$195
  Top 0.305: U$99.SDO U$100.SDI
N$196
  Top 0.305: U$99.CKO U$100.CKI
N$197
  Top 0.305: U$98.SDO U$99.SDI
N$198
  Top 0.305: U$98.CKO U$99.CKI
N$199
  Top 0.305: U$97.SDO U$98.SDI
N$200
  Top 0.305: U$97.CKO U$98.CKI
N$201
  Top 0.305: U$119.CKO U$120.CKI
N$202
  Top 0.305: U$119.SDO U$120.SDI
N$203
  Top 0.305: U$118.CKO U$119.CKI
N$204
  Top 0.305: U$118.SDO U$119.SDI
N$205
  Top 0.305: U$117.SDO U$118.SDI
N$206
  Top 0.305: U$117.CKO U$118.CKI
N$207
  Top 0.305: U$116.SDO U$117.SDI
N$208
  Top 0.305: U$116.CKO U$117.CKI
N$209
  Top 0.305: U$115.SDO U$116.SDI
N$210
  Top 0.305: U$115.CKO U$116.CKI
N$213
  Top 0.305: U$113.SDO U$114.SDI
N$214
  Top 0.305: U$113.CKO U$114.CKI
N$215
  Top 0.305: U$112.SDO U$113.SDI
N$216
  Top 0.305: U$112.CKO U$113.CKI
N$217
  Top 0.305: U$111.SDO U$112.SDI
N$218
  Top 0.305: U$111.CKO U$112.CKI
N$219
  Top 0.305: U$110.SDO U$111.SDI
N$220
  Top 0.305: U$110.CKO U$111.CKI
N$221
  Top 0.305: U$109.SDO U$110.SDI
N$222
  Top 0.305: U$109.CKO U$110.CKI
N$223
  Top 0.305: U$131.CKO U$132.CKI
N$224
  Top 0.305: U$131.SDO U$132.SDI
N$225
  Top 0.305: U$130.CKO U$131.CKI
N$226
  Top 0.305: U$130.SDO U$131.SDI
N$227
  Top 0.305: U$129.SDO U$130.SDI
N$228
  Top 0.305: U$129.CKO U$130.CKI
N$229
  Top 0.305: U$128.SDO U$129.SDI
N$230
  Top 0.305: U$128.CKO U$129.CKI
N$231
  Top 0.305: U$127.SDO U$128.SDI
N$232
  Top 0.305: U$127.CKO U$128.CKI
N$235
  Top 0.305: U$125.SDO U$126.SDI
N$236
  Top 0.305: U$125.CKO U$126.CKI
N$237
  Top 0.305: U$124.SDO U$125.SDI
N$238
  Top 0.254: U$124.CKO U$125.CKI
N$239
  Top 0.305: U$123.SDO U$124.SDI
N$240
  Top 0.305: U$123.CKO U$124.CKI
N$241
  Top 0.305: U$122.SDO U$123.SDI
N$242
  Top 0.305: U$122.CKO U$123.CKI
N$243
  Top 0.305: U$121.SDO U$122.SDI
N$244
  Top 0.305: U$121.CKO U$122.CKI
N$245
  Top 0.305: U$143.CKO U$144.CKI
N$246
  Top 0.305: U$143.SDO U$144.SDI
N$247
  Top 0.305: U$142.CKO U$143.CKI
N$248
  Top 0.305: U$142.SDO U$143.SDI
N$249
  Top 0.305: U$141.SDO U$142.SDI
N$250
  Top 0.305: U$141.CKO U$142.CKI
N$251
  Top 0.305: U$140.SDO U$141.SDI
N$252
  Top 0.305: U$140.CKO U$141.CKI
N$253
  Top 0.305: U$139.SDO U$140.SDI
N$254
  Top 0.305: U$139.CKO U$140.CKI
N$255
  Top 0.305: U$138.SDO U$139.SDI
N$256
  Top 0.305: U$138.CKO U$139.CKI
N$257
  Top 0.305: U$137.SDO U$138.SDI
N$258
  Top 0.305: U$137.CKO U$138.CKI
N$261
  Top 0.305: U$135.SDO U$136.SDI
N$262
  Top 0.305: U$135.CKO U$136.CKI
N$263
  Top 0.305: U$134.SDO U$135.SDI
N$264
  Top 0.305: U$134.CKO U$135.CKI
N$265
  Top 0.305: U$133.SDO U$134.SDI
N$266
  Top 0.305: U$133.CKO U$134.CKI
N$269
  Top 0.305: U$24.SDO U$25.SDI
N$270
  Top 0.305: U$24.CKO U$25.CKI
N$271
  Top 0.305: U$37.SDI U$36.SDO
N$272
  Top 0.305: U$36.CKO U$37.CKI
N$273
  Top 0.305: U$48.SDO U$49.SDI
N$274
  Top 0.305: U$48.CKO U$49.CKI
N$277
  Top 0.305: U$72.SDO U$73.SDI
N$278
  Top 0.305: U$72.CKO U$73.CKI
N$279
  Top 0.305: U$85.SDI U$84.SDO
N$280
  Top 0.305: U$84.CKO U$85.CKI
N$281
  Top 0.305: U$97.SDI U$96.SDO
N$282
  Top 0.305: U$97.CKI U$96.CKO
N$283
  Top 0.305: U$147.SDO U$148.SDI
N$284
  Top 0.305: U$147.CKO U$148.CKI
N$285
  Top 0.305: U$146.SDO U$147.SDI
N$286
  Top 0.305: U$146.CKO U$147.CKI
N$287
  Top 0.305: U$145.SDO U$146.SDI
N$288
  Top 0.305: U$145.CKO U$146.CKI
N$289
  Top 0.305: U$108.SDO U$109.SDI
N$290
  Top 0.305: U$108.CKO U$109.CKI
N$291
  Top 0.305: U$120.SDO U$121.SDI
N$292
  Top 0.305: U$120.CKO U$121.CKI
N$293
  Top 0.305: U$132.SDO U$133.SDI
N$294
  Top 0.305: U$132.CKO U$133.CKI
SD-01  (via drill 0.25)
  Top 0.305: v29.95,43.75 U$4.SDO | v12.25,40.85 U$5.SDI
  Bottom 0.305: v12.25,40.85 16,44.6 29.2,44.6 29.95,43.85 v29.95,43.75
SD-02  (via drill 0.25)
  Top 0.305: v35.75,40.85 U$12.SDO | v9.35,37.95 U$13.SDI
  Bottom 0.305: v9.35,37.95 10.3,38.9 13.71,38.9 13.72,38.89 34.44,38.89 35.15,39.6 35.15,40.25 v35.75,40.85
SD-03  (via drill 0.25)
  Top 0.305: v38.65,37.95 U$22.SDO | v6.45,35.05 U$23.SDI
  Bottom 0.305: v6.45,35.05 7.4,36 37.19,36 38.09,36.9 38.09,37.28 38.1,37.29 38.1,37.5 38.55,37.95 v38.65,37.95
SD-04  (via drill 0.25)
  Top 0.305: U$34.SDO v41.55,35.05 | v6.45,32.15 U$35.SDI
  Bottom 0.305: v41.55,35.05 39.35,35.05 37.45,33.15 7.45,33.15 v6.45,32.15
SD-05  (via drill 0.25)
  Top 0.305: U$46.SDO v41.55,32.15 | v3.55,29.25 U$47.SDI
  Bottom 0.305: v3.55,29.25 7.45,29.25 10.4,32.2 41.5,32.2 v41.55,32.15
SD-06  (via drill 0.25)
  Top 0.305: U$60.SDO v44.45,29.25 | U$61.SDI v3.55,26.35
  Bottom 0.305: v3.55,26.35 36.25,26.35 39.15,29.25 v44.45,29.25
SD-07  (via drill 0.25)
  Top 0.305: U$74.SDO v44.45,26.35 | v3.55,23.45 U$75.SDI
  Bottom 0.305: v3.55,23.45 4.05,23.95 42.55,23.95 43.6,25 43.6,25.5 v44.45,26.35
SD-08  (via drill 0.25)
  Top 0.305: v3.55,20.55 U$89.SDI | U$88.SDO v44.45,23.45
  Bottom 0.305: v3.55,20.55 3.6,20.55 4.4,21.35 42.95,21.35 43.75,22.15 43.75,22.95 44.25,23.45 v44.45,23.45
SD-09  (via drill 0.25)
  Top 0.305: v6.45,17.65 U$103.SDI | v44.45,20.55 U$102.SDO
  Bottom 0.305: v6.45,17.65 24.8,17.65 27.59,20.44 44.34,20.44 v44.45,20.55
SD-10  (via drill 0.25)
  Top 0.305: v6.45,14.75 U$115.SDI | U$114.SDO v41.55,17.65
  Bottom 0.305: v6.45,14.75 7.3,15.6 25.75,15.6 27.8,17.65 v41.55,17.65
SD-11  (via drill 0.25)
  Top 0.305: v9.35,11.85 U$127.SDI | U$126.SDO v41.55,14.75
  Bottom 0.305: v9.35,11.85 24.9,11.85 27.8,14.75 v41.55,14.75
SD-12  (via drill 0.25)
  Top 0.305: v12.25,8.95 U$137.SDI | U$136.SDO v38.65,11.85
  Bottom 0.305: v12.25,8.95 24.95,8.95 27.8,11.8 38.6,11.8 v38.65,11.85
SD-13  (via drill 0.25)
  Top 0.305: v35.75,8.95 U$144.SDO | v18.05,6.05 U$145.SDI
  Bottom 0.305: v18.05,6.05 24.95,6.05 27.85,8.95 v35.75,8.95
VCC  (via drill 0.25)
  Top 0.254: v28.35,4.75 U$148.VDD | v25.45,4.75 U$147.VDD | v22.55,4.75 U$146.VDD | v19.65,4.75 U$145.VDD | v13.85,7.65 U$137.VDD | v16.75,7.65 U$138.VDD | v19.65,7.65 U$139.VDD | v22.55,7.65 U$140.VDD | v25.45,7.65 U$141.VDD | v28.35,7.65 U$142.VDD | v31.25,7.65 U$143.VDD | v34.15,7.65 U$144.VDD | v37.05,10.55 U$136.VDD | v34.15,10.55 U$135.VDD | v31.25,10.55 U$134.VDD | v28.35,10.55 U$133.VDD | v25.45,10.55 U$132.VDD | v22.55,10.55 U$131.VDD | v19.65,10.55 U$130.VDD | v16.75,10.55 U$129.VDD | v13.85,10.55 U$128.VDD | v10.95,10.55 U$127.VDD | v8.05,13.45 U$115.VDD | v10.95,13.45 U$116.VDD | v13.85,13.45 U$117.VDD | v16.75,13.45 U$118.VDD | v19.65,13.45 U$119.VDD | v22.55,13.45 U$120.VDD | v25.45,13.45 U$121.VDD | v28.35,13.45 U$122.VDD | v31.25,13.45 U$123.VDD | v34.15,13.45 U$124.VDD | v37.05,13.45 U$125.VDD | v39.95,13.45 U$126.VDD | v39.95,16.35 U$114.VDD | v37.05,16.35 U$113.VDD | v34.15,16.35 U$112.VDD | v31.25,16.35 U$111.VDD | v28.35,16.35 U$110.VDD | v25.45,16.35 U$109.VDD | v22.55,16.35 U$108.VDD | v19.65,16.35 U$107.VDD | v16.75,16.35 U$106.VDD | v13.85,16.35 U$105.VDD | v10.95,16.35 U$104.VDD | v8.05,16.35 U$103.VDD | v5.15,19.25 U$89.VDD | v8.05,19.25 U$90.VDD | v10.95,19.25 U$91.VDD | v13.85,19.25 U$92.VDD | v16.75,19.25 U$93.VDD | v19.65,19.25 U$94.VDD | v22.55,19.25 U$95.VDD | v25.45,19.25 U$96.VDD | v28.35,19.25 U$97.VDD | v31.25,19.25 U$98.VDD | v34.15,19.25 U$99.VDD | v37.05,19.25 U$100.VDD | v39.95,19.25 U$101.VDD | v42.85,19.25 U$102.VDD | v42.85,22.15 U$88.VDD | v39.95,22.15 U$87.VDD | v37.05,22.15 U$86.VDD | v34.15,22.15 U$85.VDD | v31.25,22.15 U$84.VDD | v28.35,22.15 U$83.VDD | v25.45,22.15 U$82.VDD | v22.55,22.15 U$81.VDD | v19.65,22.15 U$80.VDD | v19.65,25.05 U$66.VDD
  Top 0.254: v22.55,25.05 U$67.VDD | v25.45,25.05 U$68.VDD | v28.35,25.05 U$69.VDD | v31.25,25.05 U$70.VDD | v34.15,25.05 U$71.VDD | v37.05,25.05 U$72.VDD | v39.95,25.05 U$73.VDD | v42.85,25.05 U$74.VDD | v42.85,27.95 U$60.VDD | v39.95,27.95 U$59.VDD | v37.05,27.95 U$58.VDD | v34.15,27.95 U$57.VDD | v31.25,27.95 U$56.VDD | v28.35,27.95 U$55.VDD | v25.45,27.95 U$54.VDD | v25.45,30.85 U$41.VDD | v28.35,30.85 U$42.VDD | v31.25,30.85 U$43.VDD | v34.15,30.85 U$44.VDD | v37.05,30.85 U$45.VDD | v39.95,30.85 U$46.VDD | v39.95,33.75 U$34.VDD | v37.05,33.75 U$33.VDD | v34.15,33.75 U$32.VDD | v31.25,33.75 U$31.VDD | v28.35,33.75 U$30.VDD | v25.45,33.75 U$29.VDD | v25.45,36.65 U$18.VDD | v28.35,36.65 U$19.VDD | v31.25,36.65 U$20.VDD | v34.15,36.65 U$21.VDD | v37.05,36.65 U$22.VDD | v34.15,39.55 U$12.VDD | v31.25,39.55 U$11.VDD | v28.35,39.55 U$10.VDD | v25.45,39.55 U$9.VDD | v22.55,39.55 U$8.VDD | v19.65,39.55 U$7.VDD | v16.75,39.55 U$6.VDD | v19.65,42.45 U$1.VDD | v22.55,42.45 U$2.VDD | v25.45,42.45 U$3.VDD | v28.35,42.45 U$4.VDD | v22.55,36.65 U$17.VDD | v19.65,36.65 U$16.VDD | v16.75,36.65 U$15.VDD | v19.65,33.75 U$27.VDD | v22.55,33.75 U$28.VDD | v16.75,33.75 U$26.VDD | v22.55,30.85 U$40.VDD | v19.65,30.85 U$39.VDD | v16.75,30.85 U$38.VDD | v16.75,27.95 U$51.VDD | v19.65,27.95 U$52.VDD | v22.55,27.95 U$53.VDD | v16.75,25.05 U$65.VDD | v16.75,22.15 U$79.VDD | v13.85,22.15 U$78.VDD | v10.95,22.15 U$77.VDD | v8.05,22.15 U$76.VDD | v5.15,22.15 U$75.VDD | v5.15,25.05 U$61.VDD | v8.05,25.05 U$62.VDD | v10.95,25.05 U$63.VDD | v13.85,25.05 U$64.VDD | v13.85,27.95 U$50.VDD | v10.95,27.95 U$49.VDD | v8.05,27.95 U$48.VDD | v5.15,27.95 U$47.VDD | v8.05,30.85 U$35.VDD | v10.95,30.85 U$36.VDD | v13.85,30.85 U$37.VDD | v13.85,33.75 U$25.VDD
  Top 0.254: v10.95,33.75 U$24.VDD | v8.05,33.75 U$23.VDD | v13.85,39.55 U$5.VDD | v10.95,36.65 U$13.VDD | v13.85,36.65 U$14.VDD
  pour Bottom: 1,24 arc180 47,24 arc180

### Text on the board
tPlace: BLACK (ps)EYE | CKI | SDI | GND | VCC | GND | VCC | VCC | GND | Droid Builders Japan
bPlace: ver 1.02